# EAGLE design MK12_PIR (EAGLE 9.0.1)

## Sheet 1 of 2
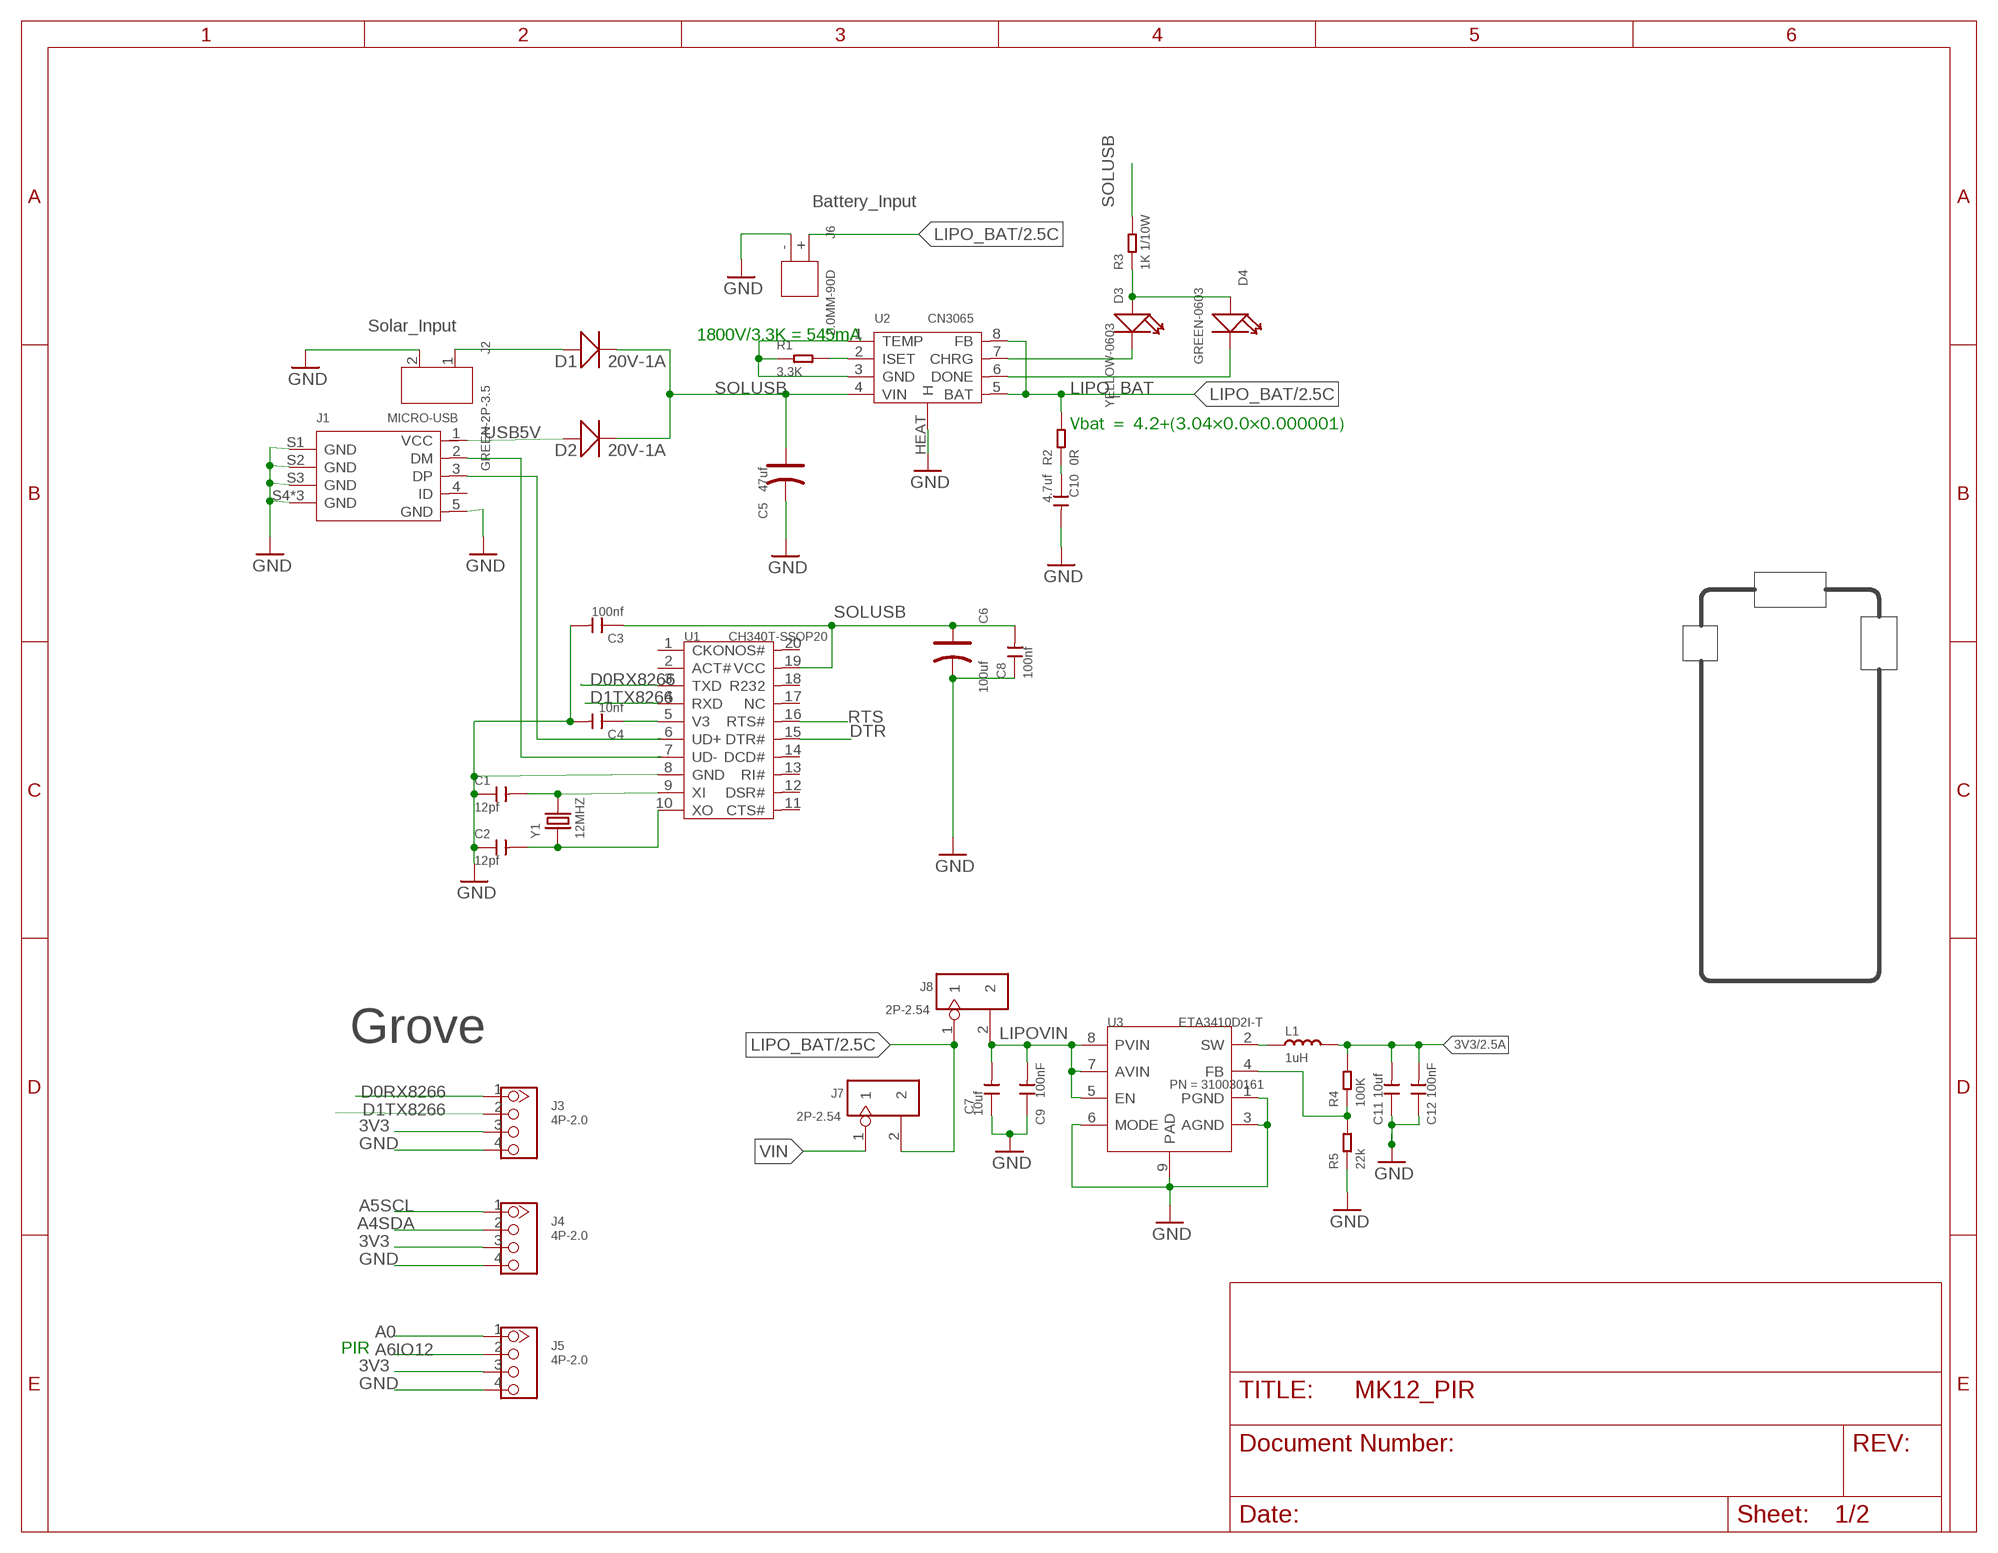
[diagram p0: schematic, sheet 1]

### Parts
C1  12pf  CERAMIC-12PF-50V-5%-NPO(0402)  [C0402]
C2  12pf  CERAMIC-12PF-50V-5%-NPO(0402)  [C0402]
C3  100nf  CERAMIC-100NF-50V-10%-X7R(0603)  [C0603]
C4  10nf  CERAMIC-10NF-50V-10%-X7R(0603)  [C0603]
C5  47uf  TANTALUM-SMD-47UF-6.3V(AVX-A)  [AVX-A]
C6  100uf  TANTALUM-SMD-100UF-10V(AVX-B)  [AVX-B]
C7  10uf  CERAMIC-10UF-25V-10%-X5R(0805)  [C0805]
C8  100nf  CERAMIC-100NF-50V-10%-X7R(0603)  [C0603]
C9  100nF  CAP-0402  [C0402]
C10  4.7uf  CERAMIC-4.7UF-10V-10%-X5R(0603)  [C0603]
C11  10uf  CERAMIC-10UF-25V-10%-X5R(0805)  [C0805]
C12  100nF  CAP-0402  [C0402]
D1  20V-1A  SMD-DIODE-SCHOTTKY-20V-1A(SOD-123)  [SOD-123]
D2  20V-1A  SMD-DIODE-SCHOTTKY-20V-1A(SOD-123)  [SOD-123]
D3  YELLOW-0603  SMD-LED-CLEAR-YELLOW(0603)  [LED-0603]
D4  GREEN-0603  SMD-LED-CLEAR-GREEN(0603)  [LED-0603]
J1  MICRO-USB  MICRO-USB5+4P'5+4P'  [MICRO-USB5+4P-SMD-0.65-B]
J2  GREEN-2P-3.5  SCREW-TERMINAL-GREEN(2P-3.5)  [H2-3.5-7.0X7.0MM]
J3  4P-2.0  GROVE-CONNECTOR-DIP(4P-2.0)  [HW4-2.0]
J4  4P-2.0  GROVE-CONNECTOR-DIP(4P-2.0)  [HW4-2.0]
J5  4P-2.0  GROVE-CONNECTOR-DIP(4P-2.0)  [HW4-2.0]
J6  2.0MM-90D  CONN-HEADER-PH-SIDE-(2P-2.0MM)'90D'  [H2-2.0-90D]
J7  2P-2.54  DIP-WHITE-MALE-HEADER-VERT(2P-2.54)  [H2-2.54]
J8  2P-2.54  DIP-WHITE-MALE-HEADER-VERT(2P-2.54)  [H2-2.54]
L1  1uH  INDUCTOR/FERRITE-BEAD'0603'  [L0603]
R1  3.3K  SMD-RES-3.3K-5%-1/10W(0603)  [R0603]
R2  0R  SMD-RES-0R-5%-1/10W(0603)  [R0603]
R3  1K 1/10W  SMD-RES-1K-5%-1/10W(0603)  [R0603]
R4  100K  SMD-RES-100K-1%-1/16W(0402)  [R0402]
R5  22k  SMD-RES-22K-1%-1/16W(0402)  [R0402]
U1  CH340T-SSOP20  INTERFACE-CH340T(SSOP20)  [SSOP20-0.65-7.6X5.2MM]
U2  CN3065  PMIC-CN3065-DFN8  [DFN-8]
U3  ETA3410D2I-T  CONVERTER-ETA3410  [DFN8G-0.5-2X2MM]
Y1  12MHZ  SMD-CRYSTAL-12MHZ-20PF-20PPM-40R(2P-5.0X3.2MM)  [X2-SMD-5.0X3.2X1.3MM]

### Nets
3V3 [POWER]: C11.2 C12.2 J3.3 J4.3 J5.3 L1.2 R4.2 ; also sheet 2
A0: J5.1 ; also sheet 2
A4SDA: J4.2 ; also sheet 2
A5SCL: J4.1 ; also sheet 2
A6IO12: J5.2 ; also sheet 2
D0RX8266: J3.1 U1.3(TXD) ; also sheet 2
D1TX8266: J3.2 U1.4(RXD) ; also sheet 2
DTR: U1.15(DTR#) ; also sheet 2
GND [POWER]: C1.1 C2.1 C3.2 C4.2 C5.- C6.- C7.1 C8.1 C9.1 C10.2 C11.1 C12.1 J1.5(GND) J1.S1(GND) J1.S2(GND) J1.S3(GND) J1.S4(GND) J1.S5(GND) J1.S6(GND) J2.2 J3.4 J4.4 J5.4 J6.- R1.1 R5.1 U1.8(GND) U2.1(TEMP) U2.3(GND) U2.HEAT(H) U3.1(PGND) U3.3(AGND) U3.6(MODE) U3.9(PAD) ; also sheet 2
LIPO_BAT [POWER]: J6.+ J7.2 J8.1 R2.2 U2.5(BAT) U2.8(FB) ; also sheet 2
LIPOVIN: C7.2 C9.2 J8.2 U3.5(EN) U3.7(AVIN) U3.8(PVIN)
N$2: D3.+ D4.+ R3.1
N$3: L1.1 U3.2(SW)
N$4: R4.1 R5.2 U3.4(FB)
N$5 [POWER]: C1.2 U1.9(XI) Y1.2
N$6 [POWER]: C2.2 U1.10(XO) Y1.1
N$7: R1.2 U2.2(ISET)
N$8: D3.- U2.7(CHRG)
N$9: J1.2(DM) U1.7(UD-)
N$10: C10.1 R2.1
N$11: J1.3(DP) U1.6(UD+)
N$12: D4.- U2.6(DONE)
RTS: U1.16(RTS#) ; also sheet 2
SOLAR [VUSB]: D1.+ J2.1
SOLUSB [POWER]: C3.1 C5.+ C6.+ C8.2 D1.- D2.- R3.2 U1.19(VCC) U2.4(VIN)
USB5V [VUSB]: D2.+ J1.1(VCC)
V3: C4.1 U1.5(V3)
VIN [POWER]: J7.1 ; also sheet 2
Unconnected: J1.4(ID) U1.1(CKO) U1.2(ACT#) U1.11(CTS#) U1.12(DSR#) U1.13(RI#) U1.14(DCD#) U1.17(NC) U1.18(R232) U1.20(NOS#)

### Notes on the sheet
- Battery_Input
- Solar_Input
- 1800V/3.3K = 545mA
- Vbat ＝ 4.2+(3.04×0.0×0.000001)
- Grove
- PIR

## Sheet 2 of 2
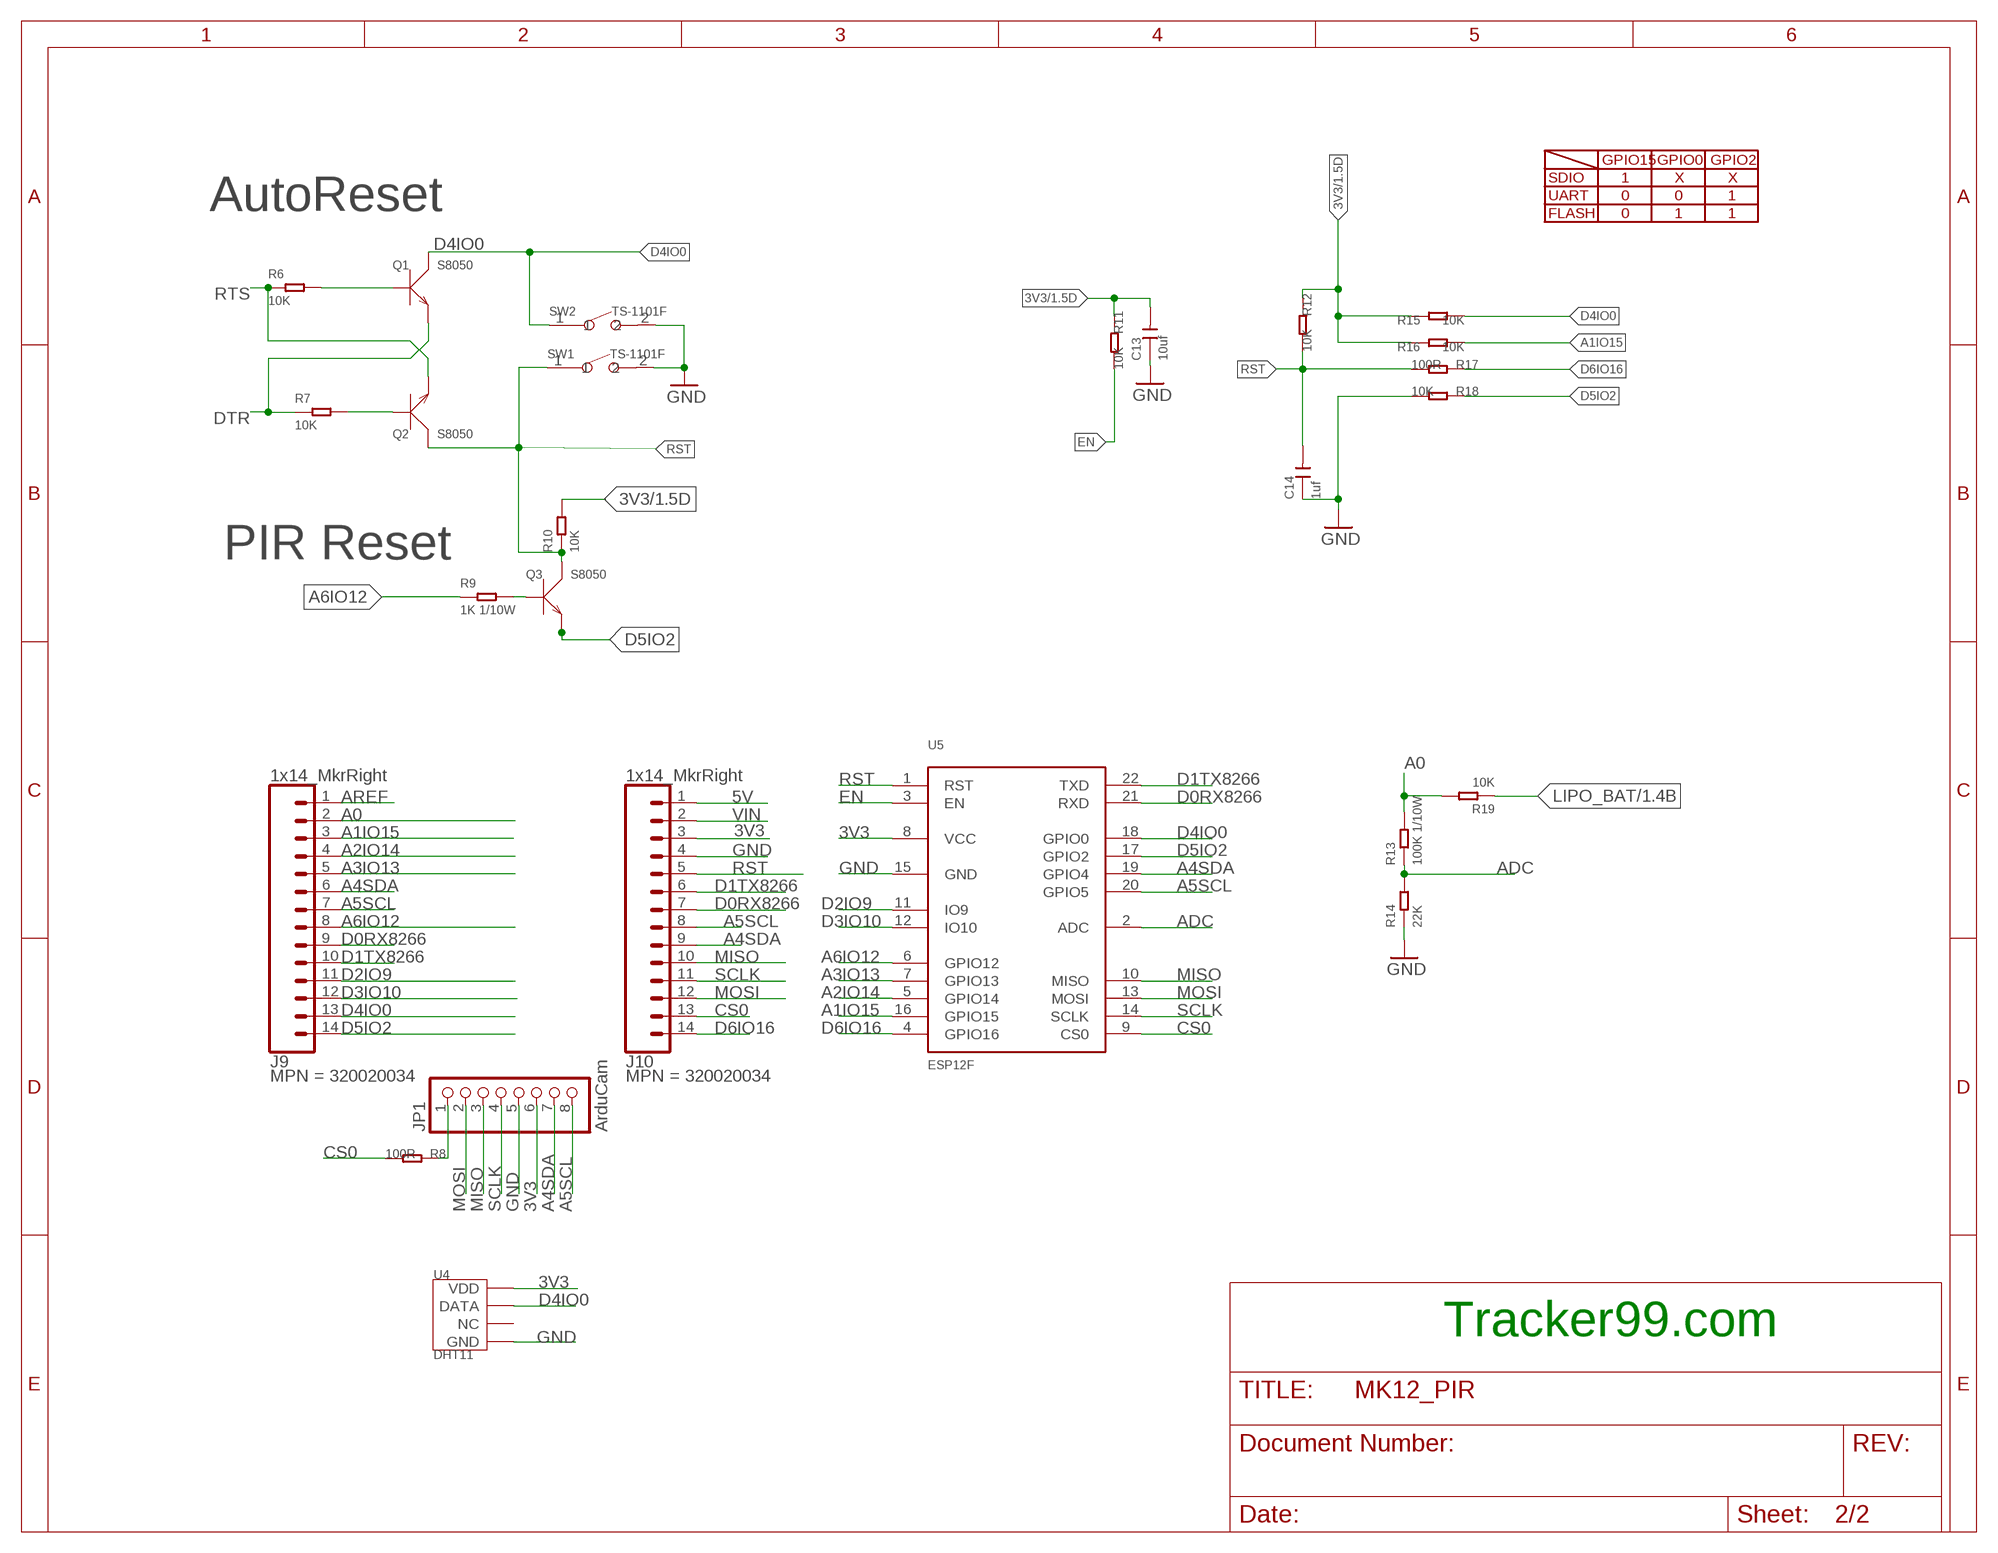
[diagram p1: schematic, sheet 2]

### Parts
C13  10uf  CERAMIC-10UF-10V-10%-X5R(0603)  [C0603]
C14  1uf  CERAMIC-1UF-25V-10%-X7R(0603)  [C0603]
J9  1x14_MkrRight  CONN_14LOCK  [1X14_LOCK]
J10  1x14_MkrRight  CONN_14LOCK  [1X14_LOCK]
JP1  ArduCam  MILLER_PINHD-1X8LOCK  [MILLER_1X08-LOCK]
Q1  S8050  SMD-TRANSISTORS-NPN-25V-500MW-S8050(SOT-23)  [SOT-23]
Q2  S8050  SMD-TRANSISTORS-NPN-25V-500MW-S8050(SOT-23)  [SOT-23]
Q3  S8050  SMD-TRANSISTORS-NPN-25V-500MW-S8050(SOT-23)  [SOT-23]
R6  10K  SMD-RES-10K-5%-1/(0402)  [R0402]
R7  10K  SMD-RES-10K-5%-1/(0402)  [R0402]
R8  100R  SMD-RES-100R-5%-1/10W(0603)  [R0603]
R9  1K 1/10W  SMD-RES-1K-5%-1/10W(0603)  [R0603]
R10  10K  SMD-RES-10K-5%-1/(0402)  [R0402]
R11  10K  SEEED-RESISTOR_SMD-RES-10K-5%-1/(0402)  [SEEED-RESISTOR_R0402]
R12  10K  SEEED-RESISTOR_SMD-RES-10K-5%-1/(0402)  [SEEED-RESISTOR_R0402]
R13  100K 1/10W  SMD-RES-100K-5%-1/10W(0603)  [R0603]
R14  22K  SMD-RES-22K-5%-1/10W(0603)  [R0603]
R15  10K  SEEED-RESISTOR_SMD-RES-10K-5%-1/(0402)  [SEEED-RESISTOR_R0402]
R16  10K  SEEED-RESISTOR_SMD-RES-10K-5%-1/(0402)  [SEEED-RESISTOR_R0402]
R17  100R  SMD-RES-100R-5%-1/10W(0603)  [R0603]
R18  10K  SEEED-RESISTOR_SMD-RES-10K-5%-1/(0402)  [SEEED-RESISTOR_R0402]
R19  10K  SMD-RES-10K-5%-1/(0402)  [R0402]
SW1  TS-1101F  DIP-BUTTON(2P-6.0X3.0X4.3MM)-TS-1101F  [SW2-5.0-6.0X3.0X4.3MM]
SW2  TS-1101F  DIP-BUTTON(2P-6.0X3.0X4.3MM)-TS-1101F  [SW2-5.0-6.0X3.0X4.3MM]
U4  DHT11  TEM-HUM-DHT11(4P-15.5X12.0MM)  [SNR4-2.54-15.5X12.0X5.5MM]
U5  ESP12F  ESP-12F  [ESP-12F]

### Nets
3V3 [POWER]: C13.2 J10.3 JP1.6 R10.2 R11.1 R12.1 R15.1 R16.1 U4.1(VDD) U5.8(VCC) ; also sheet 1
5V [POWER]: J10.1
A0: J9.2 R13.2 R19.2 ; also sheet 1
A1IO15: J9.3 R16.2 U5.16(GPIO15)
A2IO14: J9.4 U5.5(GPIO14)
A3IO13: J9.5 U5.7(GPIO13)
A4SDA: J9.6 J10.9 JP1.7 U5.19(GPIO4) ; also sheet 1
A5SCL: J9.7 J10.8 JP1.8 U5.20(GPIO5) ; also sheet 1
A6IO12: J9.8 R9.1 U5.6(GPIO12) ; also sheet 1
ADC: R13.1 R14.2 U5.2(ADC)
AREF: J9.1
CS0: J10.13 R8.2 U5.9(CS0)
D0RX8266: J9.9 J10.7 U5.21(RXD) ; also sheet 1
D1TX8266: J9.10 J10.6 U5.22(TXD) ; also sheet 1
D2IO9: J9.11 U5.11(IO9)
D3IO10: J9.12 U5.12(IO10)
D4IO0: J9.13 Q1.3(C) R15.2 SW2.1 U4.2(DATA) U5.18(GPIO0)
D5IO2: J9.14 Q3.2(E) R18.1 U5.17(GPIO2)
D6IO16: J10.14 R17.1 U5.4(GPIO16)
DTR: Q1.2(E) R7.1 ; also sheet 1
EN: R11.2 U5.3(EN)
GND [POWER]: C13.1 C14.1 J10.4 JP1.5 R14.1 R18.2 SW1.2 SW2.2 U4.4(GND) U5.15(GND) ; also sheet 1
LIPO_BAT [POWER]: R19.1 ; also sheet 1
MISO: J10.10 JP1.3 U5.10(MISO)
MOSI: J10.12 JP1.2 U5.13(MOSI)
N$1: Q3.1(B) R9.2
N$13: JP1.1 R8.1
N$14: Q2.1(B) R7.2
N$15: Q1.1(B) R6.2
N$20: Q3.3(C) R10.1
RST: C14.2 J10.5 Q2.3(C) R12.2 R17.2 SW1.1 U5.1(RST)
RTS: Q2.2(E) R6.1 ; also sheet 1
SCLK: J10.11 JP1.4 U5.14(SCLK)
VIN [POWER]: J10.2 ; also sheet 1
Unconnected: U4.3(NC)

### Notes on the sheet
- GPIO15 | GPIO0 | GPIO2
- SDIO | 1 | X | X
- UART | 0 | 0 | 1
- AutoReset
- FLASH | 0 | 1 | 1
- PIR Reset
- Tracker99.com

## Library data of the parts
C1 C2 = Seeed-Capacitor:CERAMIC-12PF-50V-5%-NPO(0402): 302010049; MPN: CC0402JRNPO9BN120
C3 C8 = Seeed-Capacitor:CERAMIC-100NF-50V-10%-X7R(0603): 302010138; MPN: CC0603KRX7R9BB104
C4 = Seeed-Capacitor:CERAMIC-10NF-50V-10%-X7R(0603): 302010140; MPN: CC0603KRX7R9BB103
C5 = Seeed-Capacitor:TANTALUM-SMD-47UF-6.3V(AVX-A): 302020005; MPN: TAJA476*006#NJ
C6 = Seeed-Capacitor:TANTALUM-SMD-100UF-10V(AVX-B): 302020015; MPN: TAJB107M010#NJ
C7 C11 = Seeed-Capacitor:CERAMIC-10UF-25V-10%-X5R(0805): 302010178; MPN: CC0805KKX5R8BB106; PN: 302010178
C9 C12 = Discrete-new:CAP: Ceramic Capacitors; PN: 302010004
C10 = Seeed-Capacitor:CERAMIC-4.7UF-10V-10%-X5R(0603): 302010111; MPN: CC0603KRX5R6BB475
C13 = Seeed-Capacitor:CERAMIC-10UF-10V-10%-X5R(0603): 302010103; MPN: CC0603KRX5R6BB106
C14 = Seeed-Capacitor:CERAMIC-1UF-25V-10%-X7R(0603): 302010139; MPN: CC0603KRX7R8BB105
D1 D2 = Seeed-OPL-2017-01-Diode-james:SMD-DIODE-SCHOTTKY-20V-1A(SOD-123): 304020034; MPN: B5819W
D3 = Seeed-LED:SMD-LED-CLEAR-YELLOW(0603): 304090044; MPN: 19-217-Y5C-AM1N1VY-3T
D4 = Seeed-LED:SMD-LED-CLEAR-GREEN(0603): 304090043; MPN: 19-217-G7C-AN1P2-3T
J1 = Connector-new:MICRO-USB5+4P: 5+4P-SMD-0.65-B:320010000;5+2P-SMD-0.65-AB:340032001; EAGLEUP: USB-MICROB;2.54mm
J2 = Seeed-Connector:SCREW-TERMINAL-GREEN(2P-3.5): 320110028
J3-J5 = Seeed-Connector:GROVE-CONNECTOR-DIP(4P-2.0): 320110033
J6 = Seeed-Connector:CONN-HEADER-PH-SIDE-(2P-2.0MM): 320110027
J7 J8 = Seeed-Connector:DIP-WHITE-MALE-HEADER-VERT(2P-2.54): 320020037; MPN: P125-1102A0BS116A3
J9 J10 = SparkFun-Connectors:CONN_14: Multi connection point. Often used as Generic Header-pin footprint for 0.1 inch spaced/style header connections On any of the 0.1 inch spaced packages, you can populate with these: Break Away Headers - Straight <https://www.sparkfun.com/products/116> (PRT-00116) Break Away Male Headers - Right Angle <https://www.sparkfun.com/products/553> (PRT-00553) Female Headers <https://www.sparkfun.com/products/115> (PRT-00115) Break Away Headers - Machine Pin <https://www.sparkfun.com/products/117> (PRT-00117) Break Away Female Headers - Swiss Machine Pin <https://www.sparkfun.com/products/743> (PRT-00743) For SCREWTERMINALS and SPRING TERMINALS visit here: Screw Terimnals on SparkFun.com <https://www.sparkfun.com/search/results?term=Screw+Terminals> (5mm/3.5mm/2.54mm spacing) This device is also useful as a general connection point to wire up your design to another part of your project. Our various solder wires solder well into these plated through hole pads. Hook-Up Wire - Assortment (Stranded, 22 AWG) <https://www.sparkfun.com/products/11375> (PRT-11375) Hook-Up Wire - Assortment (Solid Core, 22 AWG) <https://www.sparkfun.com/products/11367> (PRT-11367) View the entire wire category on our website here <https://www.sparkfun.com/categories/141> Special notes: Molex polarized connector foot print use with SKU : PRT-08231 with associated crimp pins and housings. 1MM SMD Version SKU: PRT-10208 NOTES ON THE VARIANTS LOCK and LOCK_LONGPADS... This footprint was designed to help hold the alignment of a through-hole component (i.e. 6-pin header) while soldering it into place. You may notice that each hole has been shifted either up or down by 0.005 of an inch from it's more standard position (which is a perfectly straight line). This slight alteration caused the pins (the squares in the middle) to touch the edges of the holes. Because they are alternating, it causes a "brace" to hold the component in place. 0.005 has proven to be the perfect amount of "off-center" position when using our standard breakaway headers. Although looks a little odd when you look at the bare footprint, once you have a header in there, the alteration is very hard to notice. Also,if you push a header all the way into place, it is covered up entirely on the bottom side.; MPN: 320020034
JP1 = MKR12FUNO99:MILLER_PINHD-1X8: PIN HEADER
L1 = Discrete-new:INDUCTOR/FERRITE-BEAD; PN: 303010110
Q1-Q3 = Seeed-Transistor:SMD-TRANSISTORS-NPN-25V-500MW-S8050(SOT-23): 305010017; MPN: S8050
R1 = Seeed-Resistor:SMD-RES-3.3K-5%-1/10W(0603): 301010112
R2 = Seeed-Resistor:SMD-RES-0R-5%-1/10W(0603): 301010292; MPN: RC0603JR-070RL
R3 R9 = Seeed-Resistor:SMD-RES-1K-5%-1/10W(0603): 301010291; MPN: RC0603JR-071KL
R4 = Seeed-Resistor:SMD-RES-100K-1%-1/16W(0402): 301010456; MPN: RC0402FR-07100KL; PN: 301010666
R5 = Seeed-Resistor:SMD-RES-22K-1%-1/16W(0402); MPN: RC0402FR-0722KL
R6 R7 R10 R19 = Seeed-Resistor:SMD-RES-10K-5%-1/(0402): 301010004; MPN: RC0402JR-0710KL
R8 R17 = Seeed-Resistor:SMD-RES-100R-5%-1/10W(0603): 301010090; MPN: RC0603JR-07100RL
R11 R12 R15 R16 R18 = R3Mkr12F_Solar:SEEED-RESISTOR_SMD-RES-10K-5%-1/(0402): 301010004; MPN: RC0402JR-0710KL
R13 = Seeed-Resistor:SMD-RES-100K-5%-1/10W(0603): 301010089; MPN: RC0603JR-07100KL; PN: 301010666
R14 = Seeed-Resistor:SMD-RES-22K-5%-1/10W(0603): 301010132; MPN: RC0603JR-0722KL
SW1 SW2 = Seeed-Switch:DIP-BUTTON(2P-6.0X3.0X4.3MM): 311020025; MPN: TS-1101F
U1 = Seeed-IC:INTERFACE-CH340T(SSOP20): 310070026; MPN: CH340T
U2 = IC-new:PMIC-CN3065: 310030101
U3 = template:CONVERTER-ETA3410: 3MHZ 2A High Step-Down Converter in DFN2x2-8L Package; PN: 310030161
U4 = Seeed-Sensor:TEM-HUM-DHT11(4P-15.5X12.0MM): 314010000; MPN: DHT11
U5 = Seeed-OPL-2017-01-Sensor-camilo:ESP-12F: 317060163
Y1 = Seeed-Crystal Oscillator:SMD-CRYSTAL-12MHZ-20PF-20PPM-40R(2P-5.0X3.2MM): 306010047; MPN: 5032/2P

## Net classes
0 default: width 0.152 mm, drill 0.152 mm, clearance 0.152 mm
1 POWER: width 0.305 mm, clearance 0.152 mm
2 VUSB: width 0.305 mm, clearance 0.203 mm

## Board
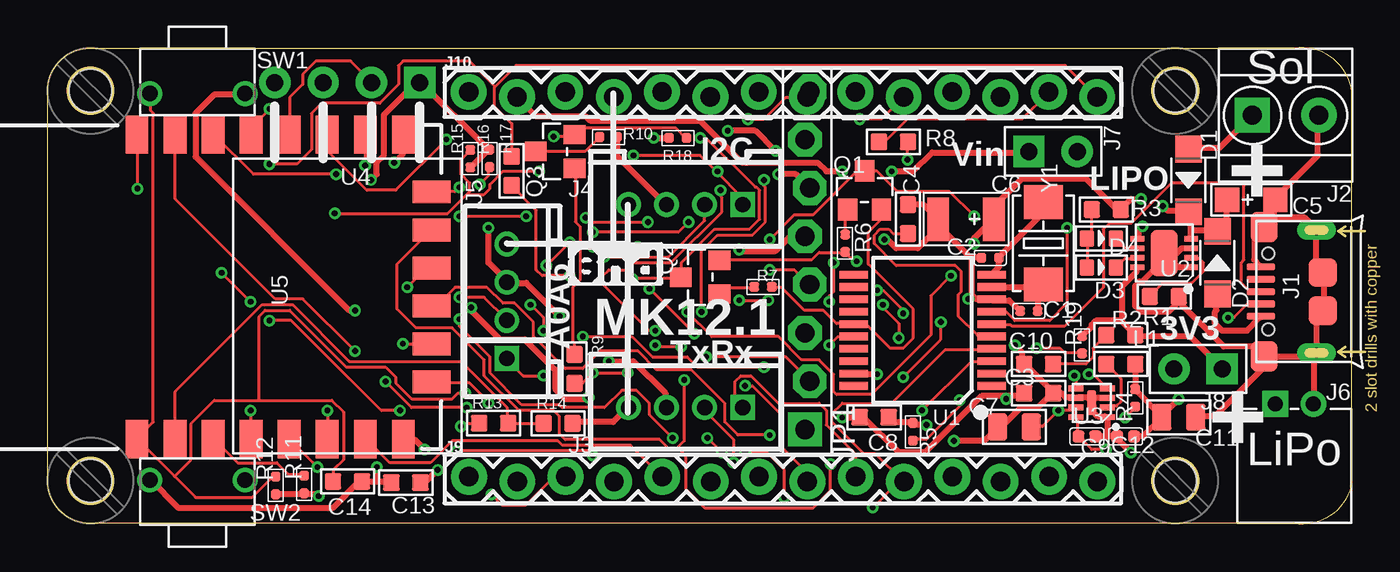
[diagram p2: board, top side]
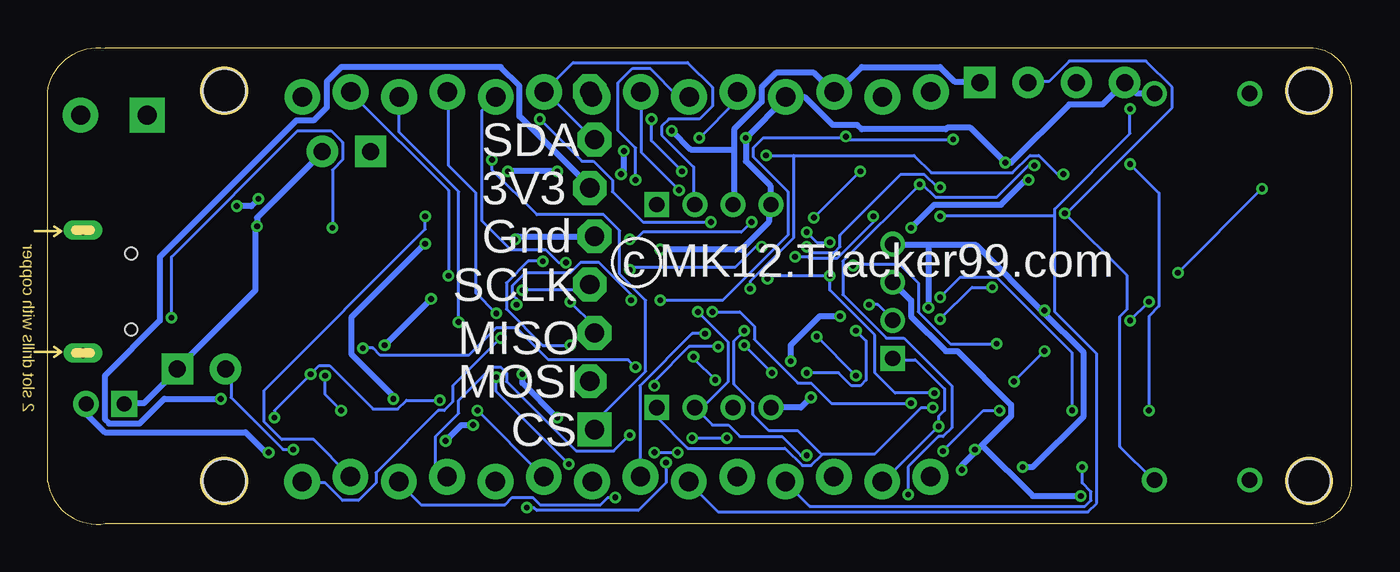
[diagram p3: board, bottom side, seen from below]

Size 68.54 x 25.05 mm. Coordinates in mm from the lower left corner, seen from the top.
Outline: 0,2.28 0,22.78 arc-90 2.25,25.03 65.5,25.03 arc-90 68.54,22.73 68.54,2.23 arc-90 65.5,0.03 2.25,0.03 arc-90 0,2.28
Copper layers (1*16): Top 0.035mm / dielectric 1.5mm / Bottom 0.035mm
Design rules "SeeedStudio_2layer_DRU_no_angle_20140221 *": minimum track width 6mil, minimum drill 12mil, track to track 6mil, track to pad 6mil, pad to pad 6mil, via to via 6mil, smd to smd 0mil, copper to edge 10mil, drill to drill 10mil, minimum pad ring 10mil, minimum via ring 6mil, stop-mask expansion 2mil, vias tented up to drill 100mil, thermal gap 10mil
Holes 2.25 mm at 2.25,2.28 59.25,2.28 59.25,22.78 2.25,22.78
tRestrict: area 0,0.1 to 4.5,4.5; area 0,20.6 to 4.5,25; area 57,20.6 to 61.5,25; area 57,0.1 to 61.5,4.5; area 0,4.4 to 4.1,20.4; area 10.7,24.4 to 57.9,25.4; area 10.2,-0.5 to 57.4,0.5; 26 lines
bRestrict: area 0,0.1 to 4.5,4.5; area 0,20.6 to 4.5,25; area 57,0.1 to 61.5,4.5; area 57,20.6 to 61.5,25; area 0,4.4 to 4.1,20.4; area 10.7,24.4 to 57.9,25.4; area 10.7,-0.5 to 57.4,0.5; 25 lines

### Footprints (pad centres in the part's own frame; a part is rotated, then mirrored left to right if it is on the bottom)
C0402 = smd 0.5 x 0.5: 1 0,0.463; 2 0,-0.463
C0603 = smd 0.889 x 0.889: 1 0,0.762; 2 0,-0.762
AVX-A = smd 1.27 x 1.27: + -1.27,0; - 1.27,0
AVX-B = smd 1.143 x 2.286: + -1.46,0; - 1.46,0
C0805 = smd 1.397 x 1.016: 1 0,0.889; 2 0,-0.889
C0402' = smd 0.635 x 0.635: 1 0,0.445; 2 0,-0.445
SOD-123 = smd 1.397 x 1.397: + -1.651,0; - 1.651,0
LED-0603 = smd 0.762 x 0.889: + -0.762,0; - 0.762,0
MICRO-USB5+4P-SMD-0.65-B = smd 0.381 x 1.524: 1 -1.3,-0.25; 2 -0.65,-0.25; 3 0,-0.25; 4 0.65,-0.25; 5 1.3,-0.25 | smd 1.6 x 1.397: S1 -3.4,-0.427; S6 3.4,-0.427 | drill 0.508 pad 1.016 long: S2 -3.226,-3.175; S5 3.226,-3.175 | smd 1.5 x 1.5: S3 -1,-3.5; S4 1,-3.5 | hole 0.635: -2,-0.65; 2,-0.65
H2-3.5-7.0X7.0MM = drill 1 pad 1.85 square: 1 -1.75,0 | drill 1 pad 1.85: 2 1.75,0
HW4-2.0 = drill 0.8 pad 1.27 square: 1 -3,0 | drill 0.8 pad 1.27: 2 -1,0; 3 1,0; 4 3,0
H2-2.0-90D = drill 0.8 pad 1.35 square: + -1,3.25 | drill 0.8 pad 1.35: - 1,3.25
H2-2.54 = drill 0.889 pad 1.651 square: 1 0,1.27 | drill 0.889 pad 1.651: 2 0,-1.27
1X14_LOCK = drill 1.016 pad 1.88: 1 0,0.127; 2 2.54,-0.127; 3 5.08,0.127; 4 7.62,-0.127; 5 10.16,0.127; 6 12.7,-0.127; 7 15.24,0.127; 8 17.78,-0.127; 9 20.32,0.127; 10 22.86,-0.127; 11 25.4,0.127; 12 27.94,-0.127; 13 30.48,0.127; 14 33.02,-0.127
MILLER_1X08-LOCK = drill 1.016 pad 1.778 square: 1 -8.89,0.127 | drill 1.016 pad 1.778 octagon: 2 -6.35,-0.127; 3 -3.81,0.127; 4 -1.27,-0.127; 5 1.27,0.127; 6 3.81,-0.127; 7 6.35,0.127; 8 8.89,-0.127
L0603 = smd 0.889 x 0.889: 1 -0.762,0; 2 0.762,0
SOT-23 = smd 1.016 x 1.143: 1 -0.889,-1.016; 2 0.889,-1.016; 3 0,1.016
R0603 = smd 0.889 x 0.889: 1 0,0.762; 2 0,-0.762
R0402 = smd 0.5 x 0.5: 1 0,0.463; 2 0,-0.463
SEEED-RESISTOR_R0402 = smd 0.5 x 0.5: 1 0,0.463; 2 0,-0.463
SW2-5.0-6.0X3.0X4.3MM = drill 0.8 pad 1.27: 1 -2.5,0; 2 2.5,0
SSOP20-0.65-7.6X5.2MM = smd 0.4 x 1.5: 1 -2.925,-3.625; 2 -2.275,-3.625; 3 -1.625,-3.625; 4 -0.975,-3.625; 5 -0.325,-3.625; 6 0.325,-3.625; 7 0.975,-3.625; 8 1.625,-3.625; 9 2.275,-3.625; 10 2.925,-3.625; 11 2.925,3.625; 12 2.275,3.625; 13 1.625,3.625; 14 0.975,3.625; 15 0.325,3.625; 16 -0.325,3.625; 17 -0.975,3.625; 18 -1.625,3.625; 19 -2.275,3.625; 20 -2.925,3.625
DFN-8 = smd 0.3 x 0.727: 1 -0.75,-1.413; 2 -0.25,-1.413; 3 0.25,-1.413; 4 0.75,-1.413; 5 0.75,1.413; 6 0.25,1.413; 7 -0.25,1.413; 8 -0.75,1.413 | smd 2.413 x 1.397: HEAT 0,0
DFN8G-0.5-2X2MM = smd 0.8 x 0.3: 1 -0.827,0.75; 2 -0.827,0.25; 3 -0.827,-0.25; 4 -0.827,-0.75; 5 0.827,-0.75; 6 0.827,-0.25; 7 0.827,0.25; 8 0.827,0.75 | smd 0.45 x 1.3: 9 0,0
SNR4-2.54-15.5X12.0X5.5MM = drill 0.889 pad 1.651 square: 1 -11.75,3.81 | drill 0.889 pad 1.651: 2 -11.75,1.27; 3 -11.75,-1.27; 4 -11.75,-3.81
ESP-12F = smd 2 x 1.2: 1 -8,3.48; 2 -8,1.48; 3 -8,-0.52; 4 -8,-2.52; 5 -8,-4.52; 6 -8,-6.52; 7 -8,-8.52; 8 -8,-10.52; 15 8,-10.52; 16 8,-8.52; 17 8,-6.52; 18 8,-4.52; 19 8,-2.52; 20 8,-0.52; 21 8,1.48; 22 8,3.48 | smd 1.2 x 2: 9 -5,-12; 10 -3,-12; 11 -1,-12; 12 1,-12; 13 3,-12; 14 5,-12
X2-SMD-5.0X3.2X1.3MM = smd 1.778 x 2.032: 1 -2.159,0; 2 2.159,0

### Placement (x,y rotation side)
C1  51.56,11.21 90 top
C2  49.53,14 90 top
C3  52.07,6.89 90 top
C4  45.21,16.03 180 top
C5  63.25,17.05 0 top
C6  48.26,16.03 180 top
C7  50.8,5.11 90 top
C8  43.43,5.62 270 top
C9  100nF  [C0402']  54.61,4.6 270 top
C10  52.07,8.41 270 top
C11  59.44,5.62 270 top
C12  100nF  [C0402']  56.64,4.6 90 top
C13  18.83,2.19 90 top
C14  15.76,2.24 270 top
D1  59.94,18.07 270 top
D2  61.47,13.75 90 top
D3  55.37,13.49 0 top
D4  55.37,15.02 0 top
J1  63.5,12.22 90 top
J2  65.05,21.5 0 top
J3  33.53,6.13 180 top
J4  33.53,16.8 180 top
J5  24.13,11.72 90 top
J6  65.51,3.07 0 top
J7  52.83,19.59 90 top
J8  60.45,8.16 270 top
J9  22.14,2.37 0 top
J10  22.13,22.59 0 top
JP1  39.92,13.86 90 top
L1  56.39,8.41 0 top
Q1  42.93,17.56 0 top
Q2  34.29,12.99 90 top
Q3  26.67,19.59 90 top
R1  58.67,11.97 270 top
R2  56.39,9.94 90 top
R3  55.63,16.54 90 top
R4  57.15,6.64 180 top
R5  45.47,4.86 0 top
R6  41.91,14.76 180 top
R7  37.59,12.48 270 top
R8  44.45,20.1 270 top
R9  27.69,8.16 180 top
R10  29.46,20.35 90 top
R11  13.49,2.09 180 top
R12  11.99,2.03 180 top
R13  23.44,5.31 270 top
R14  26.82,5.29 270 top
R15  22.21,19.22 180 top
R16  23.22,19.23 0 top
R17  24.38,18.57 0 top
R18  33.11,20.3 270 top
R19  54.36,9.43 0 top
SW1  7.87,22.64 0 top
SW2  7.87,2.32 180 top
U1  45.97,10.19 90 top
U2  58.67,14.26 90 top
U3  54.86,6.38 180 top
U4  15.75,11.46 270 top
U5  8.18,12.47 90 top
U$5  [MH_RND_F_2.2MM_NM]  2.25,2.28 90 top
U$6  [MH_RND_F_2.2MM_NM]  2.25,22.78 90 top
U$7  [MH_RND_F_2.2MM_NM]  59.25,22.78 90 top
U$8  [MH_RND_F_2.2MM_NM]  59.25,2.28 90 top
Y1  52.32,14.76 270 top

### Tracks (layer width: path | path; a pad name or v marks a point on that pad's centre or on a via)
3V3  (via drill 0.3)
  Top 0.305: R15.1 22.25,18.78 23.16,19.69 R16.1 23.09,19.77 19.58,23.27 U4.1 19.43,23.12 19.28,23.12 17.68,21.52 17.68,19.39 17.3,19.01 17.3,18.4 v16.99,18.09 | R10.2 29.95,20.3 29.95,19.31 32.46,16.8 J4.3 | R12.1 12.04,1.56 13.41,1.56 R11.1 13.56,1.56 14.17,1.56 v14.25,1.48 | v20.5,2.85 19.89,2.24 19.66,2.24 C13.2 | v19.81,3.92 19.28,4.45 18.75,4.45 U5.8 | v29.49,8.57 30.79,8.57 32.46,6.89 32.46,6.13 J3.3 | v26.9,10.93 25.15,12.68 24.16,12.68 J5.3 24.08,12.83 23.16,13.75 v23.16,15.58 | L1.2 R4.2 57.23,6.97 58.52,5.67 C11.2 | C12.2 57.53,4.6 C11.2 | v59.44,6.59 58.6,5.75 C11.2 | v35.74,20.68 37.19,20.68 v38.25,19.62 | v38.41,18.4 39.32,18.4 40.01,17.71 JP1.6
  Bottom 0.305: 32.46,19.69 32.46,20.76 31.01,22.21 31.01,22.97 30.25,23.73 28.27,23.73 27.28,22.74 J10.3 27.05,22.74 25.76,24.04 21.64,24.04 20.88,23.27 19.58,23.27 U4.1 | 32.46,19.69 32.46,16.8 J4.3 | v20.5,2.85 20.5,3.08 19.74,3.84 | 19.43,4.15 17.91,5.67 17.91,6.28 20.73,9.1 21.34,9.1 23.16,10.93 23.16,11.77 24.08,12.68 J5.3 | 19.43,4.15 19.74,3.84 | v14.25,1.48 16.76,1.48 19.43,4.15 | v19.81,3.92 19.74,3.84 | v29.49,8.57 29.49,9.41 27.96,10.93 v26.9,10.93 | v16.99,18.09 17.14,18.09 18.44,16.8 21.95,16.8 v23.16,15.58 | v59.44,6.59 62.41,6.59 63.7,5.29 65.3,5.29 65.53,5.52 65.53,7.8 62.64,10.7 62.64,14.05 55.47,21.22 54.56,21.22 53.87,21.9 53.87,23.27 53.11,24.04 44.73,24.04 43.74,23.04 43.74,21.44 40.01,17.71 JP1.6 | 32.46,19.69 34.75,19.69 v35.74,20.68 | v38.25,19.62 38.25,18.55 v38.41,18.4
A0  (via drill 0.3)
  Top 0.152: v21.72,5.14 21.87,5.29 22.63,5.29 R13.2 | v51.97,9.25 53.19,9.25 53.42,9.02 54.33,9.02 R19.2 | v37.64,8.26 34.14,8.26 33.6,8.8 31.77,8.8 30.71,9.86 v28.12,9.86 | v26.06,7.8 24.99,7.8 24.16,8.64 J5.1
  Bottom 0.152: J9.2 24.61,2.24 v21.72,5.14 21.72,5.67 21.41,5.98 21.41,7.12 22.94,8.64 24.08,8.64 J5.1 | v51.97,9.25 51.44,9.25 51.05,8.87 46.41,8.87 44.96,10.32 43.89,10.32 42.22,8.64 38.02,8.64 v37.64,8.26 | v26.06,7.8 v28.12,9.86
A1IO15  (via drill 0.3)
  Top 0.152: v22.71,17.86 23.16,18.32 23.16,18.7 R16.2 | v16.69,18.85 16.69,20.45 U5.16 | v23.32,1.56 23.85,1.02 25.15,1.02 26.59,2.47 27.2,2.47 J9.3
  Bottom 0.152: v16.69,18.85 16.99,18.85 18.67,17.18 21.87,17.18 22.55,17.86 v22.71,17.86 26.75,13.82 26.75,12.07 24.46,9.79 23.55,9.79 21.03,7.27 21.03,5.06 21.49,4.6 21.72,4.6 23.32,3 v23.32,1.56
A2IO14  (via drill 0.3)
  Top 0.152: v14.17,3 12.72,4.45 U5.5
  Bottom 0.152: v14.17,3 14.17,2.17 13.72,1.71 13.72,1.25 14.02,0.95 28.5,0.95 29.72,2.17 J9.4
A3IO13
  Top 0.152: U5.7 16.76,4.45 17.98,3.23 20.12,3.23 21.26,4.38 26.82,4.38 27.05,4.15 30.63,4.15 32.23,2.55 J9.5
A4SDA  (via drill 0.3)
  Top 0.152: v11.66,21.83 10.74,20.91 10.74,20.53 U5.19 | v29.26,14.05 32.61,14.05 34.52,15.96 34.52,16.8 J4.2 | v21.64,16.19 v25.15,16.19
  Bottom 0.152: J4.2 34.59,16.8 34.59,18.78 36.27,20.45 36.27,20.91 35.89,21.29 34.29,21.29 33.6,21.98 33.6,22.97 34.9,24.26 40.92,24.26 42.44,22.74 J10.9 42.37,22.74 39.85,20.23 JP1.7 | v11.66,21.83 11.66,20.53 15.62,16.57 15.62,16.19 | 15.62,16.19 15.62,11.16 13.41,8.95 13.41,1.1 13.87,0.64 33.3,0.64 34.82,2.17 J9.6 | v29.26,14.05 28.57,14.05 28.5,13.98 27.05,13.98 25.15,15.88 v25.15,16.19 | 15.62,16.19 v21.64,16.19
A5SCL  (via drill 0.3)
  Top 0.152: J10.8 39.93,22.51 40.01,22.59 40.01,22.74 JP1.8 39.85,22.44 38.79,22.44 37.64,21.29 v36.8,21.29 | v15.16,18.4 10.82,18.4 8.76,20.45 U5.20 | v30.79,19.39 34.29,19.39 35.17,18.51 | 35.17,18.51 36.5,17.18 36.5,16.8 J4.1 | v31.62,12.38 v33.98,10.01 | v35.2,18.55 35.17,18.51
  Bottom 0.152: v15.16,18.4 15.47,18.4 16.46,19.39 16.92,19.39 17.83,18.47 22.1,18.47 23.01,19.39 29.34,19.39 | v30.79,19.39 29.34,19.39 | v33.98,10.01 34.67,10.01 37.41,7.27 37.41,2.55 J9.7 | v31.62,12.38 31.62,12.76 29.34,15.04 29.34,19.39 | v36.8,21.29 36.8,20.15 v35.2,18.55
A6IO12  (via drill 0.3)
  Top 0.152: v26.06,10.17 26.06,10.85 v25.38,11.54 | R9.1 27.74,7.42 28.12,7.42 v28.65,7.96 v30.48,7.96 | v14.71,5.98 14.71,4.53 U5.6 | v21.64,11.92 22.94,11.92 24.08,10.78 J5.2 | v36.65,7.27 37.03,7.27 38.48,5.82 38.48,4.15 39.85,2.78 39.85,2.24 J9.8 | v33.3,9.33 32,9.33 v31.93,9.41
  Bottom 0.152: v28.65,7.96 26.98,7.96 26.29,7.27 25.83,7.27 25.53,7.58 25.53,9.63 v26.06,10.17 | v25.38,11.54 24.92,11.54 24.16,10.78 J5.2 | v14.71,5.98 14.71,9.02 18.67,12.99 20.57,12.99 v21.64,11.92 | v36.65,7.27 36.65,7.5 34.82,9.33 v33.3,9.33 | v30.48,7.96 v31.93,9.41
ADC
  Top 0.152: R14.2 25.98,5.29 24.23,5.29 R13.1 24.16,5.37 24.16,6.13 21.72,8.57 15.85,8.57 12.88,11.54 11.28,11.54 6.71,6.97 6.71,4.53 U5.2
CS0  (via drill 0.3)
  Top 0.152: R8.2 43.74,20.15 44.04,20.15 45.19,21.29 51.21,21.29 52.58,22.66 J10.13 | v23.16,6.36 23.16,6.43 22.17,7.42 20.19,7.42 U5.9 | v33.6,11.16 34.9,9.86 38.41,9.86 39.62,8.64 40.54,8.64 41.3,7.88 41.3,6.97 41.45,6.81 43.28,6.81 46.41,9.94 46.41,12 v47.47,13.06
  Bottom 0.152: v23.16,6.36 27.36,6.36 28.42,7.42 29.11,7.42 31.39,9.71 31.39,10.4 32.16,11.16 v33.6,11.16 | v47.47,13.06 47.47,17.56 52.58,22.66 J10.13
D0RX8266  (via drill 0.3)
  Top 0.152: v45.95,5.98 48.54,8.57 49.53,8.57 U1.3 | v16.15,9.1 13.41,11.84 11.96,11.84 6.71,17.1 6.71,20.45 U5.21 | v17.75,7.5 19.13,6.13 v22.02,6.13 | v35.36,17.56 35.36,17.25 35.43,17.18 35.43,16.42 32.77,13.75 30.79,13.75 30.4,13.37 29.49,13.37 29.18,13.06 29.18,12.61 31.62,10.17 v31.93,10.17 | J9.9 42.44,2.55 42.44,3.69 40.92,5.21 40.92,5.98 40.54,6.36 38.41,6.36 36.96,7.8 36.42,7.8 36.12,7.5 36.12,6.51 36.5,6.13 J3.1
  Bottom 0.152: v45.95,5.98 42.52,2.55 J9.9 | v17.75,7.5 v16.15,9.1 | v22.02,6.13 22.63,6.13 25.07,3.69 27.81,3.69 27.85,3.65 | 27.85,3.65 28.42,3.08 28.88,3.08 29.79,3.99 34.9,3.99 36.5,5.6 36.5,6.13 J3.1 | v35.36,17.56 37.34,19.54 37.34,22.66 J10.7 | v31.93,10.17 32.46,9.63 32.46,7.35 31.47,6.36 31.47,5.75 30.63,4.91 29.11,4.91 27.85,3.65
D1TX8266  (via drill 0.3)
  Top 0.152: U1.4 49.53,9.18 47.17,9.18 44.35,6.36 41.76,6.36 41.22,5.82 41.22,5.37 42.9,3.69 43.51,3.69 44.96,2.24 J9.10 44.81,2.32 v43.36,0.87 | v4.72,17.63 4.72,20.45 U5.22 | v10.67,11.69 v9.14,13.22 | v11.66,10.7 12.8,10.7 17.53,5.98 v18.52,5.98 | v21.49,3.84 28.42,3.84 v28.65,3.61 | v37.64,18.09 37.64,17.79 37.72,17.71 37.72,15.88 37.03,15.2 35.2,15.2 34.37,14.36 v34.37,11.16 | v36.04,3.23 36.04,4.45 34.59,5.9 34.59,6.13 J3.2
  Bottom 0.152: v9.14,13.22 v4.72,17.63 | v11.66,10.7 v10.67,11.69 | v18.52,5.98 19.36,5.98 v21.49,3.84 | v28.65,3.61 28.96,3.61 29.95,4.6 32.16,4.6 32.77,5.21 33.6,5.21 34.52,6.13 J3.2 34.29,5.98 32.77,7.5 32.77,9.56 v34.37,11.16 | v37.64,18.09 37.64,19.77 38.56,20.68 38.56,23.2 37.8,23.96 36.88,23.96 35.43,22.51 34.9,22.51 J10.6 | v43.36,0.87 42.98,0.87 42.82,0.72 37.49,0.72 36.04,2.17 v36.04,3.23
D2IO9  (via drill 0.3)
  Top 0.152: v37.95,4.68 36.27,4.68 35.59,5.37 35.59,6.36 33.83,8.11 32,8.11 31.01,9.1 29.03,9.1 28.12,8.19 27.2,8.19 25.53,9.86 25.53,10.62 24.54,11.61 23.93,11.61 23.09,12.45 21.41,12.45 20.5,11.54 20.19,11.54 U5.11
  Bottom 0.152: v37.95,4.68 38.79,3.84 40.77,3.84 44.42,7.5 44.42,7.96 44.73,8.26 45.19,8.26 46.94,6.51 46.94,5.82 48.16,4.6 48.16,3.16 47.55,2.55 J9.11
D3IO10  (via drill 0.3)
  Top 0.152: v18.9,12.45 19.89,13.44 20.12,13.44 U5.12 | v21.64,10.78 21.64,10.4 23.24,8.8 23.24,7.96 24.92,6.28 26.9,6.28 27.05,6.13 29.26,6.13 30.18,7.04 30.94,7.04 31.62,6.36 31.62,5.75 v32.84,4.53 | v35.43,3.77 v34.67,4.53 | v36.65,3.77 37.8,3.77 38.71,2.85 v38.71,1.4
  Bottom 0.152: v18.9,12.45 19.96,12.45 v21.64,10.78 | v34.67,4.53 v32.84,4.53 | v36.65,3.77 v35.43,3.77 | v38.71,1.4 39.09,1.4 39.47,1.02 42.67,1.02 43.05,1.4 44.12,1.4 44.5,1.02 48.92,1.02 50.06,2.17 J9.12
D4IO0  (via drill 0.3)
  Top 0.152: v48.69,16.19 47.4,17.48 44.65,17.48 43.59,18.55 42.98,18.55 Q1.3 42.9,18.55 42.52,18.55 40.23,16.26 39.24,16.26 v37.95,14.97 | U5.18 12.72,20.53 12.72,22.44 13.41,23.12 13.41,23.65 14.1,24.34 15.93,24.34 16.99,23.27 U4.2 | 22.06,17.37 21.03,16.34 v15.09,16.34 | 22.06,17.37 22.17,17.48 22.17,17.94 21.72,18.4 21.72,19.16 22.17,19.62 R15.2 | v31.55,15.88 28.5,15.88 v28.27,16.11 | v25.83,18.55 23.93,18.55 23.24,17.86 23.24,17.63 22.94,17.33 22.1,17.33 22.06,17.37
  Bottom 0.152: v48.69,16.19 48.69,15.5 57.15,7.04 57.15,5.37 56.24,4.45 54.56,4.45 52.65,2.55 J9.13 | SW2.1 10.44,2.32 12.19,4.07 12.19,10.93 11.81,11.31 11.81,13.06 v15.09,16.34 15.01,16.34 9.45,21.9 9.45,22.97 10.82,24.34 14.86,24.34 15.93,23.27 16.99,23.27 U4.2 | v37.95,14.97 37.64,14.97 37.26,15.35 32.08,15.35 v31.55,15.88 | v25.83,18.55 v28.27,16.11
D5IO2  (via drill 0.3)
  Top 0.152: R18.1 33.53,20.3 32.99,20.84 28.04,20.84 Q3.2 27.58,20.38 v26.59,20.38 | v20.95,20.23 18.29,17.56 16.76,17.56 14.71,19.62 14.71,20.45 U5.17 | v44.73,9.79 44.73,10.55 43.89,11.39 v43.89,11.54 | v36.35,11.77 v37.87,11.77
  Bottom 0.152: v20.95,20.23 26.44,20.23 v26.59,20.38 26.59,20.3 30.94,20.3 31.47,19.77 31.47,19.31 29.64,17.48 29.64,15.2 33.07,11.77 v36.35,11.77 | v44.73,9.79 47.24,7.27 47.24,6.43 47.7,5.98 48.01,5.98 51.28,2.7 51.28,2.17 52.2,1.25 53.03,1.25 53.95,2.17 55.09,2.17 J9.14 | v43.89,11.54 43.89,11.84 44.12,12.07 44.12,12.53 43.43,13.22 41.07,13.22 40.54,13.75 39.55,13.75 37.87,12.07 v37.87,11.77
D6IO16  (via drill 0.3)
  Top 0.152: R17.1 24.38,21.06 23.47,21.98 23.47,22.97 23.51,23.01 | 23.51,23.01 24.61,24.11 53.49,24.11 55.09,22.51 J10.14 | v10.67,5.98 10.67,4.53 U5.4 | v11.66,18.93 13.11,18.93 13.87,19.69 13.87,21.6 14.4,22.13 17.45,22.13 18.44,23.12 18.44,24.11 18.67,24.34 22.17,24.34 23.51,23.01
  Bottom 0.152: v10.67,5.98 10.67,10.93 10.13,11.46 10.13,17.41 v11.66,18.93
DTR
  Top 0.152: R7.1 38.1,12.45 38.56,12.45 39.78,11.23 40.77,11.23 41.45,10.55 42.29,10.55 U1.15 42.37,10.47 43.05,10.47 44.27,9.25 44.96,9.25 45.49,9.79 45.49,11.31 43.13,13.67 43.13,15.35 43.81,16.03 Q1.2
EN
  Top 0.152: R11.2 13.41,2.62 12.65,2.62 12.04,3.23 9.98,3.23 8.76,4.45 U5.3
GND  (via drill 0.3)
  Top 0.305: U2.1 60.05,13.52 59.36,13.52 58.67,14.21 U2.HEAT | U2.3 60.05,14.51 59.59,14.51 59.05,13.98 U2.HEAT | J1.S1 63.86,8.87 63.4,9.33 61.8,9.33 59.44,11.69 R1.1 59.36,11.61 58.9,11.16 57.45,11.16 57.15,11.46 57.15,12.53 57.38,12.76 57.53,12.76 58.75,13.98 U2.HEAT | C11.1 60.35,5.67 61.34,5.67 63.86,8.19 63.86,8.72 J1.S1 | C8.1 44.2,5.6 44.42,5.37 45.41,5.37 R5.1 45.57,5.21 v46.18,5.21 | v47.62,4.38 49.23,4.38 49.91,5.06 C7.1 49.99,5.21 50.22,5.21 51.13,6.13 52.05,6.13 52.73,6.81 C3.2 | 55.7,4.6 C12.1 56.31,4.53 56.31,4.38 v56.92,3.77 | 55.7,4.6 C9.1 | 55.7,4.6 55.7,5.6 U3.1 55.55,5.67 55.17,5.67 54.94,5.9 54.94,6.28 U3.9 | U3.9 54.86,6.43 54.63,6.66 54.1,6.66 U3.6 53.95,6.66 53.49,6.66 53.26,6.89 C3.2 | U3.3 55.63,6.66 55.09,6.66 54.94,6.51 U3.9 | C3.2 52.81,6.97 51.36,8.41 C10.2 51.21,8.49 51.21,9.02 v50.83,9.41 | J1.S6 63.93,15.65 64.47,16.19 64.47,17.03 C5.- 64.54,17.18 66.75,19.39 66.75,21.44 J2.2 | J1.5 63.7,13.6 63.4,13.9 63.4,15.04 63.86,15.5 J1.S6 | J1.S2 66.67,10.78 66.98,11.08 J1.S3 67.06,11.23 67.06,13.22 J1.S4 66.98,13.37 66.67,13.67 J1.S5 66.6,15.58 66.06,16.11 64.54,16.11 J1.S6 | J6.- 66.52,6.36 66.52,8.8 66.6,8.87 J1.S2 | J1.S1 64.08,8.8 66.45,8.8 J1.S2 | R14.1 27.58,5.37 29.72,5.37 30.48,6.13 J3.4 | 17.3,2.24 16.54,2.24 C14.1 16.38,2.24 15.01,0.87 6.86,0.87 5.41,2.32 SW2.2 | 17.3,2.24 18.06,2.24 C13.1 | 17.3,2.24 v17.3,3 | v28.42,6.66 28.27,6.66 28.19,6.59 27.2,6.59 26.67,7.12 26.67,8.11 25.07,9.71 23.77,9.71 22.25,11.23 v22.25,11.39 | C1.1 51.05,11.23 50.52,11.77 49.61,11.77 U1.8 49.45,11.84 48.77,11.84 48.58,12.03 | 48.54,14.05 48.46,14.05 46.86,15.65 46.86,16.03 C6.-
  Top 0.305: 48.54,14.05 49,14.05 C2.1 | C4.2 46.02,16.8 46.71,16.11 C6.- | 48.58,12.03 48.54,12.07 48.54,14.05 | v43.97,14.97 44.12,14.97 44.58,14.51 45.72,14.51 46.79,15.58 C6.- | v31.85,20.3 32.61,20.3 R18.2 | v18.21,19.01 18.67,19.46 18.67,20.45 U5.15 | v36.35,14.43 36.42,14.36 38.25,14.36 39.01,15.12 39.78,15.12 JP1.5 | v16.15,11.23 15.85,11.23 7.77,19.31 7.77,21.6 8.76,22.59 10.36,22.59 SW1.2 | 48.58,12.03 v48.39,11.84
  Bottom 0.305: v46.18,5.21 46.79,5.21 v47.62,4.38 | v56.92,3.77 57.07,3.77 58.14,4.83 65.53,4.83 66.45,5.75 66.45,6.28 J6.- | 22.25,14.66 19.74,14.66 16.23,11.16 | 22.25,14.66 24.08,14.66 J5.4 | 16.23,11.16 14.1,9.02 14.1,5.67 16.76,3 v17.3,3 | J3.4 28.96,6.13 v28.42,6.66 | 22.25,14.66 v22.25,11.39 | v43.97,14.97 43.81,15.12 39.85,15.12 JP1.5 | SW1.2 10.44,22.66 11.35,22.66 11.81,23.12 U4.4 11.96,23.2 13.11,22.05 14.86,22.05 17.91,19.01 v18.21,19.01 20.04,20.84 21.26,20.84 21.34,20.76 25.76,20.76 25.98,20.99 27.28,20.99 28.73,22.44 29.57,22.44 J10.4 29.72,22.44 v31.85,20.3 31.85,19.08 30.56,17.79 30.56,16.8 J4.4 30.63,16.72 30.63,15.88 32.08,14.43 v36.35,14.43 | v16.15,11.23 16.23,11.16 | v48.39,11.84 v50.83,9.41
LIPO_BAT  (via drill 0.3)
  Top 0.305: v57.53,15.65 57.3,15.42 57.3,15.04 U2.5 | 56.39,10.7 55.09,10.7 54.86,10.47 54.86,10.4 54.41,9.94 R19.1 | 56.39,10.7 R2.2 57.23,9.86 60.05,9.86 61.72,8.19 J8.1 | U2.8 57.23,13.44 57.23,13.29 56.46,12.53 56.46,10.78 56.39,10.7
  Bottom 0.305: J7.2 54.1,19.54 57.53,16.11 v57.53,15.65 57.61,15.58 57.61,12.3 61.65,8.26 J8.1 61.72,8.11 63.48,6.36 64.47,6.36 J6.+
LIPOVIN  (via drill 0.3)
  Top 0.152: 54.03,5.98 54.03,5.67 U3.8 54.1,5.6 54.1,4.6 C9.2 54.86,3.92 v55.63,3.92 | 54.03,5.98 54.03,6.13 U3.7 | v53.95,7.8 54.03,7.73 54.03,7.2 U3.5 | 54.03,5.98 v53.11,5.98 52.27,5.14 51.74,5.14 C7.2
  Bottom 0.152: v53.95,7.8 53.95,6.81 v53.11,5.98 | v55.63,3.92 56.16,3.92 58.9,6.66 58.9,7.88 J8.2
MISO  (via drill 0.3)
  Top 0.152: v18.67,9.48 20.12,9.48 U5.10 | v27.43,14.82 v26.21,13.6 | v28.65,15.35 33.15,15.35 v33.68,15.88 | v42.67,21.29 43.81,21.29 44.96,22.44 J10.10 | v41.07,11.69 41.07,12 41.3,12.22 v41.3,13.75
  Bottom 0.152: v18.67,9.48 21.11,9.48 22.78,11.16 22.78,12.68 23.77,13.67 26.14,13.67 v26.21,13.6 | v27.43,14.82 28.12,14.82 v28.65,15.35 | v33.68,15.88 37.26,15.88 38.86,17.48 38.86,18.09 39.85,19.08 40.46,19.08 v42.67,21.29 | v41.07,11.69 39.85,10.47 39.85,10.09 JP1.3 | v41.3,13.75 41.68,13.75 42.37,14.43 44.2,14.43 45.72,15.96 45.72,21.75 45.03,22.44 J10.10
MOSI  (via drill 0.3)
  Top 0.152: 33.11,4.03 33.45,4.38 v33.45,7.58 | 33.11,4.03 33.07,3.99 32.61,3.99 32.16,4.45 27.2,4.45 26.9,4.76 26.9,5.67 26.59,5.98 24.77,5.98 22.94,7.8 22.94,8.64 21.26,10.32 19.36,10.32 18.36,11.31 18.36,13.67 20.12,15.42 U5.13 | v34.59,8.8 38.79,8.8 40.01,7.58 JP1.2 | v46.94,10.62 46.94,9.71 v44.96,7.73 | v41.15,3.16 41.15,1.79 40.23,0.87 34.52,0.87 33.53,1.86 33.53,3.61 33.11,4.03
  Bottom 0.152: v33.45,7.58 34.59,8.72 v34.59,8.8 | v46.94,10.62 46.94,17.48 50.06,20.61 50.06,22.44 J10.12 | v44.96,7.73 44.96,6.97 v41.15,3.16
N$1
  Top 0.152: R9.2 27.66,8.95 27.66,9.56 27.58,9.63 27.58,12.45 27.96,12.83 27.96,15.65 27.74,15.88 27.74,18.7 Q3.1
N$2
  Top 0.152: D3.+ 54.63,13.52 54.63,14.97 D4.+ 54.86,15.27 R3.1
N$3
  Top 0.152: L1.1 56.39,7.65 56.39,6.43 56.16,6.2 55.7,6.2 U3.2
N$4  (via drill 0.3)
  Top 0.152: v47.93,6.51 47.93,6.2 46.18,4.45 45.49,4.45 R5.2 | v54.71,7.88 54.94,7.88 55.63,7.2 U3.4 | v56.62,5.6 57.15,6.13 R4.1
  Bottom 0.152: v47.93,6.51 49.68,6.51 50.14,6.05 51.44,6.05 53.72,8.34 54.25,8.34 v54.71,7.88 56.62,5.98 v56.62,5.6
N$5
  Top 0.305: C1.2 52.05,11.23 52.05,12.38 52.27,12.61 Y1.2 51.97,12.45 49.61,12.45 U1.9
N$6
  Top 0.305: U1.10 49.61,13.14 49.99,13.52 49.99,13.98 C2.2 50.06,14.13 52.27,16.34 52.27,16.87 Y1.1
N$7
  Top 0.152: U2.2 60.12,13.98 60.5,13.98 60.73,13.75 60.73,13.29 60.12,12.68 58.6,12.68 57.91,12 R1.2
N$8
  Top 0.152: D3.- 56.62,13.98 57.23,13.98 U2.7
N$9  (via drill 0.3)
  Top 0.152: v53.57,15.58 53.57,11.61 52.65,10.7 50.83,10.7 50.37,11.16 U1.7 | v62.03,10.85 62.33,10.85 63.02,11.54 63.7,11.54 J1.2
  Bottom 0.152: v53.57,15.58 53.57,18.63 53.03,19.16 53.03,20.07 53.65,20.68 55.4,20.68 62.03,14.05 v62.03,10.85
N$10
  Top 0.152: C10.1 54.56,8.41 54.94,8.8 54.94,9.25 R2.1
N$11
  Top 0.152: J1.3 63.17,12.22 62.71,12.68 62.71,13.75 62.87,13.9 62.87,17.79 62.71,17.94 59.05,17.94 56.92,15.81 55.78,15.81 55.47,15.5 55.47,12.45 53.42,10.4 50.67,10.4 50.6,10.47 49.61,10.47 U1.6
N$12
  Top 0.152: U2.6 57.23,14.51 56.62,14.51 56.16,14.97 D4.-
N$13  (via drill 0.3)
  Top 0.152: v45.19,19.16 45.19,20.07 R8.1
  Bottom 0.152: v45.19,19.16 45.19,18.63 42.82,16.26 39.32,16.26 38.48,15.42 38.48,13.14 37.11,11.77 37.11,8.03 39.78,5.37 39.78,4.99 JP1.1
N$14
  Top 0.152: Q2.1 35.66,12.45 37.11,12.45 R7.2
N$15
  Top 0.152: R6.2 41.91,16.42 Q1.1
N$20
  Top 0.152: R10.1 28.96,20.3 28.27,19.62 25.68,19.62 Q3.3
RST  (via drill 0.3)
  Top 0.152: v27.43,13.06 25.98,13.06 25.68,13.37 25.68,16.49 24.38,17.79 R17.2 | v30.71,12.91 33.15,12.91 33.22,12.99 Q2.3 33.3,12.99 33.3,13.75 35.05,15.5 36.88,15.5 37.41,16.03 37.41,17.56 37.26,17.71 37.19,17.71 34.59,20.3 v34.29,20.3 | 6.67,2.51 4.72,4.45 U5.1 4.72,4.53 5.56,5.37 5.56,21.6 5.41,21.75 5.41,22.59 SW1.1 | 6.67,2.51 7.77,1.4 10.74,1.4 11.81,2.47 11.96,2.47 R12.2 | 11.12,6.51 8.76,6.51 7.54,5.29 7.54,3.39 6.67,2.51 | 11.12,6.51 14.94,6.51 15.54,5.9 15.54,3.39 15.01,2.85 15.01,2.32 C14.2 | v21.95,6.89 21.57,6.89 21.26,6.59 19.13,6.59 18.29,7.42 18.29,7.73 17.75,8.26 15.7,8.26 12.72,11.23 11.43,11.23 11.12,10.93 11.12,6.51
  Bottom 0.152: v30.71,12.91 30.56,13.06 v27.43,13.06 27.43,12.3 25.07,9.94 25.07,7.96 24,6.89 v21.95,6.89 | v34.29,20.3 32.31,22.28 32.31,22.66 J10.5
RTS  (via drill 0.3)
  Top 0.152: 41.91,14.28 40.54,14.28 40.16,13.9 35.36,13.9 Q2.2 | v41.07,9.41 41.53,9.86 42.29,9.86 U1.16 | v42.52,13.82 42.37,13.82 41.91,14.28 | 41.91,14.28 R6.1
  Bottom 0.152: v41.07,9.41 42.52,9.41 44.42,11.31 44.42,12.68 43.28,13.82 v42.52,13.82
SCLK  (via drill 0.3)
  Top 0.152: v21.64,17.71 21.41,17.48 20.19,17.48 U5.14 | v31.01,14.59 v28.65,14.59 | v37.95,13.37 39.24,13.37 40.01,12.61 JP1.4 | v44.96,11.08 44.96,11.23 43.89,12.3 v43.59,12.3
  Bottom 0.152: v21.64,17.71 21.79,17.71 22.48,18.4 23.7,18.4 26.9,15.2 26.9,14.59 27.2,14.28 28.35,14.28 v28.65,14.59 | v31.01,14.59 31.32,14.59 32.38,13.52 37.8,13.52 v37.95,13.37 | v44.96,11.08 46.02,12.15 46.02,17.41 47.47,18.85 47.47,22.66 J10.11 | v43.59,12.3 40.31,12.3 40.08,12.53 JP1.4
SOLAR
  Top 0.305: D1.+ 59.97,19.77 61.57,19.77 63.25,21.44 J2.1
SOLUSB  (via drill 0.3)
  Top 0.305: 50.37,6.74 51.13,6.74 51.28,6.89 C3.1 | 50.37,6.74 49.07,6.74 46.1,3.77 44.73,3.77 42.9,5.6 42.67,5.6 C8.2 42.6,5.6 v41.76,5.6 | v43.59,7.88 42.37,7.88 U1.19 | 60.05,15.42 60.05,16.34 59.97,16.42 D1.- 59.82,16.49 58.83,16.49 v58.6,16.72 | 60.05,15.42 60.05,15.04 U2.4 | C5.+ 61.95,17.03 61.95,15.88 D2.- 61.34,15.42 60.05,15.42 | v57.45,17.1 56.92,17.1 56.46,16.64 R3.2 56.39,16.57 56.16,16.57 54.56,18.17 51.21,18.17 49.76,16.72 49.76,16.03 C6.+ 49.61,15.96 48.69,15.04 v48.69,14.74 | v50.37,6.59 50.37,6.74
  Bottom 0.305: v43.59,7.88 43.59,7.42 v41.76,5.6 | v58.6,16.72 57.84,16.72 v57.45,17.1 | v50.37,6.59 50.37,6.74 52.58,8.95 52.58,10.85 v48.69,14.74
USB5V
  Top 0.305: D2.+ 61.42,12.07 61.42,11.23 61.34,11.16 61.34,10.55 61.72,10.17 63.02,10.17 63.7,10.85 J1.1
V3
  Top 0.152: C4.1 44.42,15.27 44.2,15.5 43.74,15.5 43.43,15.2 43.43,14.74 44.58,13.6 47.7,13.6 48.01,13.29 48.01,12.22 47.85,12.07 47.85,10.93 48.84,9.94 49.53,9.94 U1.5
VIN  (via drill 0.3)
  Top 0.305: v44.35,18.55 45.49,18.55 46.48,19.54 51.51,19.54 J7.1 | v41.76,18.55 40.92,18.55 40.46,19.01 36.5,19.01 34.29,21.22 28.5,21.22 28.27,21.44 25.68,21.44 24.69,22.44 J10.2
  Bottom 0.305: v41.76,18.55 v44.35,18.55

### Text on the board
tPlace: Sol | I2C | Vin | LIPO | + | MK12.1 | TxRx | 3V3 | A0A6 | + | LiPo
bPlace: SDA | 3V3 | Gnd | c MK12.Tracker99.com | SCLK | MISO | MOSI | CS
test-probe: 5V | VIN(5V) | VCC | GND | RESET | 14 | 13 | 12 | 11 | 10 | 9 | 8 | 7 | 6 | USB_5V | USB_D- | SWCLK | SWDIO | JGND | JRST | VTG | BATT+ | BATT- | USB_D+ | USB_GND | AREF | A0 | A1 | A2 | A3 | A4 | A5 | A6 | 0 | 1 | 2 | 3 | 4 | 5